# EAGLE schematic Arduino (EAGLE 6.6.0)
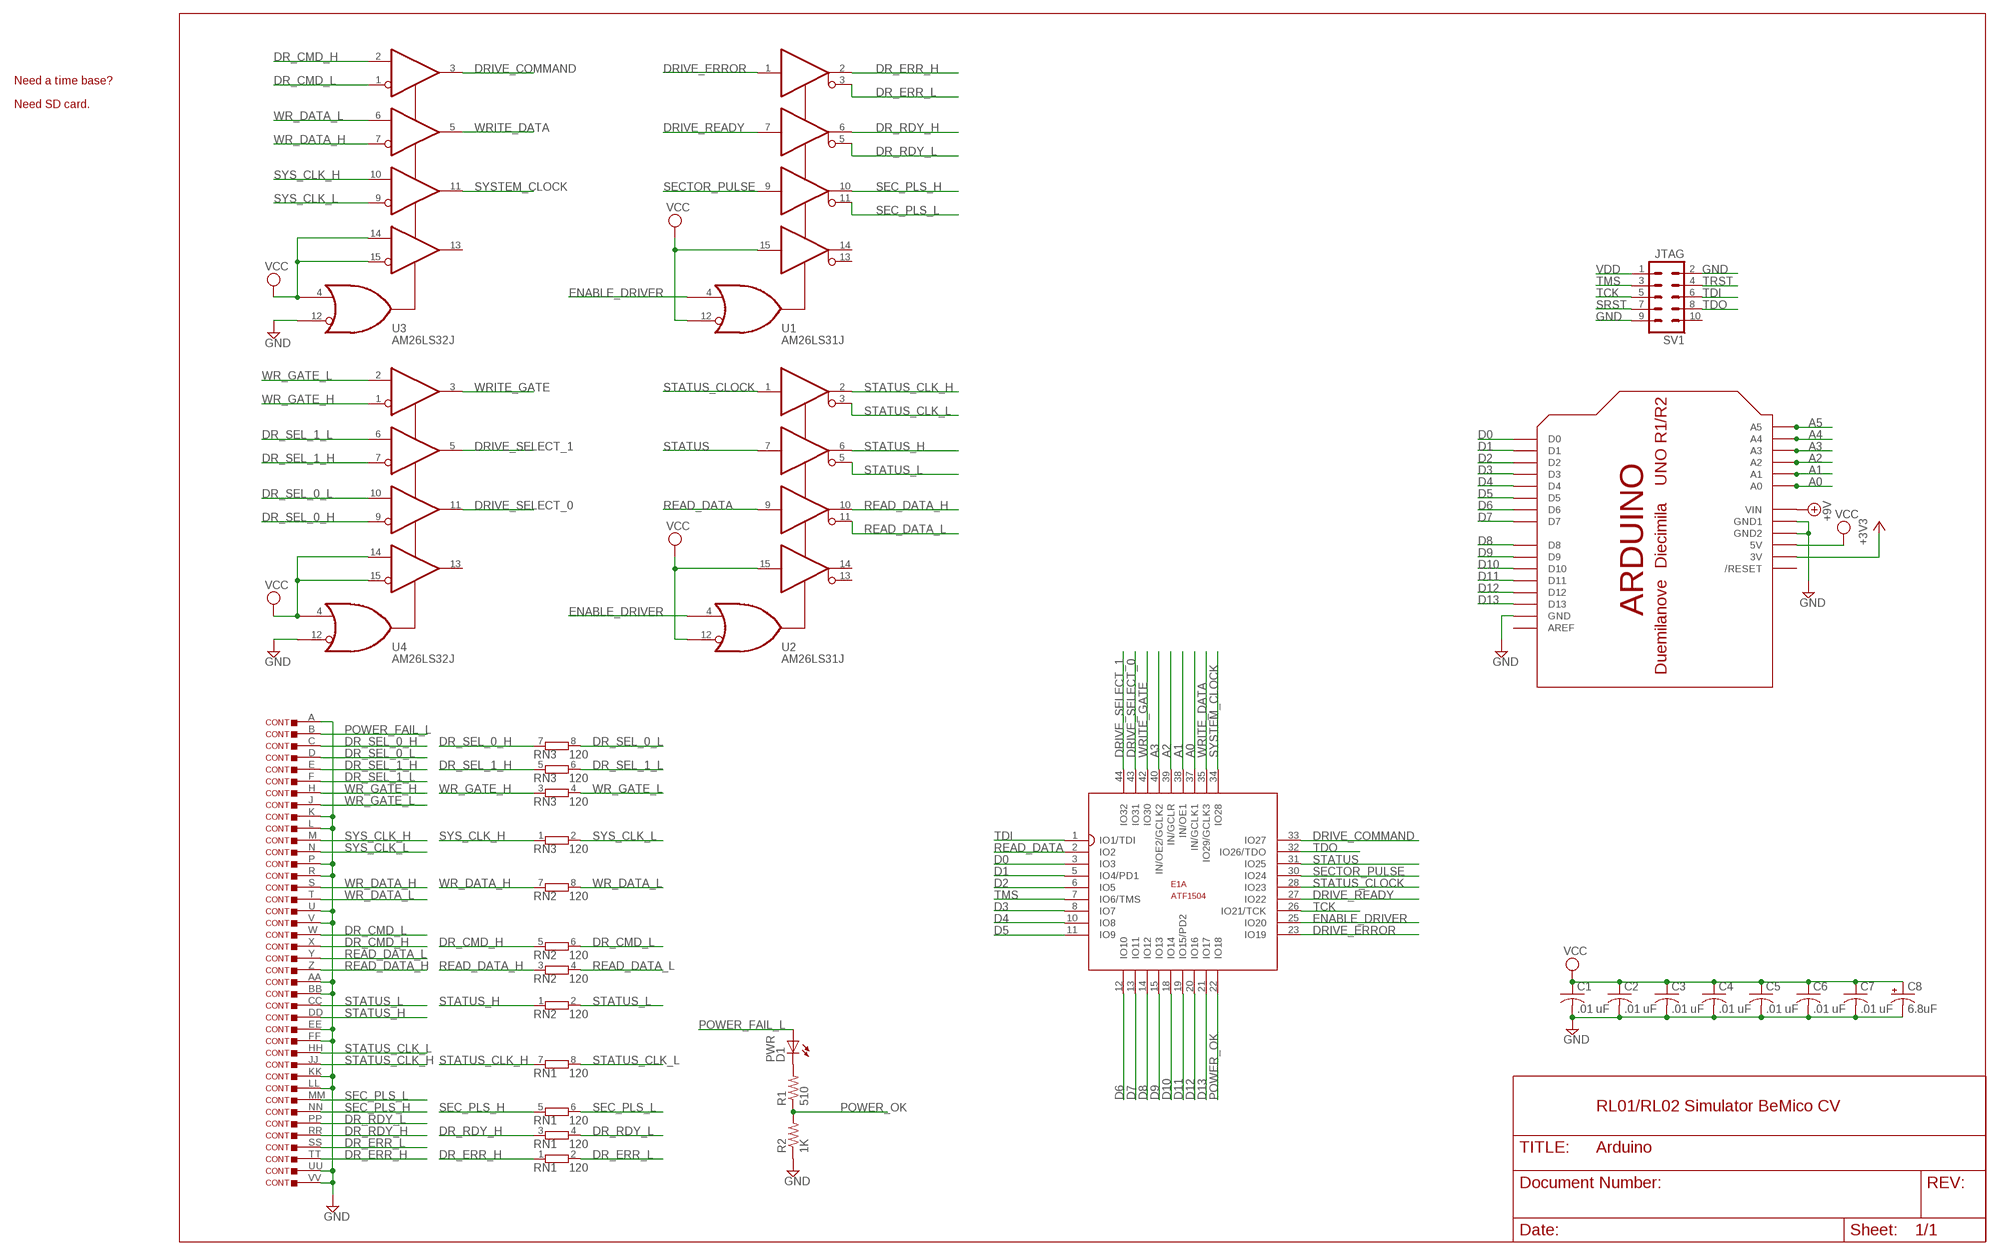
[diagram p0: schematic, sheet 1]

## Parts
C1  .01 uF  C-US050-025X075  [C050-025X075]
C2  .01 uF  C-US050-025X075  [C050-025X075]
C3  .01 uF  C-US050-025X075  [C050-025X075]
C4  .01 uF  C-US050-025X075  [C050-025X075]
C5  .01 uF  C-US050-025X075  [C050-025X075]
C6  .01 uF  C-US050-025X075  [C050-025X075]
C7  .01 uF  C-US050-025X075  [C050-025X075]
C8  6.8uF  CPOL-USE5-5  [E5-5]
CONT  DEC40PINSV  [DEC40PINV]
D1  PWR  LED5MM  [LED5MM]
E1  ATF1504  ATF150X44TQFP  [TQFP44]
R1  510  R-US_0207/10  [0207/10]
R2  1K  R-US_0207/10  [0207/10]
RN1  120  E4RP  [SIL8]
RN2  120  E4RP  [SIL8]
RN3  120  E4RP  [SIL8]
SV1  JTAG  ML10  [ML10]
U1  AM26LS31J  [SO16]
U2  AM26LS31J  [SO16]
U3  AM26LS32J  [SO16]
U4  AM26LS32J  [SO16]
U$3  ARDUINOUNO  [ARDUINO]

## Nets
+3V3: U$3.3V
+9V: U$3.VIN
A0: E1.37(A:IN/GCLK1) U$3.A0
A1: E1.38(A:IN/OE1) U$3.A1
A2: E1.39(A:IN/GCLR) U$3.A2
A3: E1.40(A:IN/OE2/GCLK2) U$3.A3
A4: U$3.A4
A5: U$3.A5
D0: E1.3(A:IO3) U$3.D0
D1: E1.5(A:IO4/PD1) U$3.D1
D2: E1.6(A:IO5) U$3.D2
D3: E1.8(A:IO7) U$3.D3
D4: E1.10(A:IO8) U$3.D4
D5: E1.11(A:IO9) U$3.D5
D6: E1.12(A:IO10) U$3.D6
D7: E1.13(A:IO11) U$3.D7
D8: E1.14(A:IO12) U$3.D8
D9: E1.15(A:IO13) U$3.D9
D10: E1.18(A:IO14) U$3.D10
D11: E1.19(A:IO15/PD2) U$3.D11
D12: E1.20(A:IO16) U$3.D12
D13: E1.21(A:IO17) U$3.D13
DR_CMD_H: CONT.X RN2.5 U3.2(P1)
DR_CMD_L: CONT.W RN2.6 U3.1(N1)
DR_ERR_H: CONT.TT RN1.1 U1.2(Y1)
DR_ERR_L: CONT.SS RN1.2 U1.3(Z1)
DR_RDY_H: CONT.RR RN1.3 U1.6(Y2)
DR_RDY_L: CONT.PP RN1.4 U1.5(Z2)
DR_SEL_0_H: CONT.C RN3.7 U4.9(N3)
DR_SEL_0_L: CONT.D RN3.8 U4.10(P3)
DR_SEL_1_H: CONT.E RN3.5 U4.7(N2)
DR_SEL_1_L: CONT.F RN3.6 U4.6(P2)
DRIVE_COMMAND: E1.33(A:IO27) U3.3(Y1)
DRIVE_ERROR: E1.23(A:IO19) U1.1(A1)
DRIVE_READY: E1.27(A:IO22) U1.7(A2)
DRIVE_SELECT_0: E1.43(A:IO31) U4.11(Y3)
DRIVE_SELECT_1: E1.44(A:IO32) U4.5(Y2)
ENABLE_DRIVER: E1.25(A:IO20) U1.4(G) U2.4(G)
GND [supply]: C1.2 C2.2 C3.2 C4.2 C5.2 C6.2 C7.2 C8.- CONT.A CONT.AA CONT.BB CONT.EE CONT.FF CONT.K CONT.KK CONT.L CONT.LL CONT.P CONT.R CONT.U CONT.UU CONT.V CONT.VV R2.1 SV1.2 SV1.9 U3.12(!G) U4.12(!G) U$3.GND U$3.GND1 U$3.GND2
N$1: D1.K(C) R1.2
N$2: U$3.AREF
N$9: U$3.RESET(/RESET)
POWER_FAIL_L: CONT.B D1.A
POWER_OK: E1.22(A:IO18) R1.1 R2.2
READ_DATA: E1.2(A:IO2) U2.9(A3)
READ_DATA_H: CONT.Z RN2.3 U2.10(Y3)
READ_DATA_L: CONT.Y RN2.4 U2.11(Z3)
SEC_PLS_H: CONT.NN RN1.5 U1.10(Y3)
SEC_PLS_L: CONT.MM RN1.6 U1.11(Z3)
SECTOR_PULSE: E1.30(A:IO24) U1.9(A3)
SRST: SV1.7
STATUS: E1.31(A:IO25) U2.7(A2)
STATUS_CLK_H: CONT.JJ RN1.7 U2.2(Y1)
STATUS_CLK_L: CONT.HH RN1.8 U2.3(Z1)
STATUS_CLOCK: E1.28(A:IO23) U2.1(A1)
STATUS_H: CONT.DD RN2.1 U2.6(Y2)
STATUS_L: CONT.CC RN2.2 U2.5(Z2)
SYS_CLK_H: CONT.M RN3.1 U3.10(P3)
SYS_CLK_L: CONT.N RN3.2 U3.9(N3)
SYSTEM_CLOCK: E1.34(A:IO28) U3.11(Y3)
TCK: E1.26(A:IO21/TCK) SV1.5
TDI: E1.1(A:IO1/TDI) SV1.6
TDO: E1.32(A:IO26/TDO) SV1.8
TMS: E1.7(A:IO6/TMS) SV1.3
TRST: SV1.4
VCC [supply]: C1.1 C2.1 C3.1 C4.1 C5.1 C6.1 C7.1 C8.+ U1.12(!G) U1.15(A4) U2.12(!G) U2.15(A4) U3.4(G) U3.14(P4) U3.15(N4) U4.4(G) U4.14(P4) U4.15(N4) U$3.5V
VDD: SV1.1
WR_DATA_H: CONT.S RN2.7 U3.7(N2)
WR_DATA_L: CONT.T RN2.8 U3.6(P2)
WR_GATE_H: CONT.H RN3.3 U4.1(N1)
WR_GATE_L: CONT.J RN3.4 U4.2(P1)
WRITE_DATA: E1.35(A:IO29/GCLK3) U3.5(Y2)
WRITE_GATE: E1.42(A:IO30) U4.3(Y1)
Unconnected: SV1.10 U1.13(Z4) U1.14(Y4) U2.13(Z4) U2.14(Y4) U3.13(Y4) U4.13(Y4)

## Notes on the sheet
- Need a time base?
- Need SD card.
- RL01/RL02 Simulator BeMico CV

## Power pins joined to a net without a drawn wire
GND: E1.4(GND) E1.16(GND) E1.24(GND) E1.36(GND) U1.8(GND) U2.8(GND) U3.8(GND) U4.8(GND)
VCC: E1.9(VCC) E1.17(VCC) E1.29(VCC) E1.41(VCC) U1.16(VCC) U2.16(VCC) U3.16(VCC) U4.16(VCC)

## Library data of the parts
C1-C7 = rcl:C-US: CAPACITOR, American symbol
C8 = rcl:CPOL-US: POLARIZED CAPACITOR, American symbol
CONT = dec-con:DEC40PINS: 40 pin ribbon connector for BC08, BC11 cables.
D1 = led:LED: LED OSRAM: - CHIPLED LG R971, LG N971, LY N971, LG Q971, LY Q971, LO R971, LY R971 LH N974, LH R974 LS Q976, LO Q976, LY Q976 LO Q996 - Hyper CHIPLED LW Q18S LB Q993, LB Q99A, LB R99A - SideLED LS A670, LO A670, LY A670, LG A670, LP A670 LB A673, LV A673, LT A673, LW A673 LH A674 LY A675 LS A676, LA A676, LO A676, LY A676, LW A676 LS A679, LY A679, LG A679 - Hyper Micro SIDELED® LS Y876, LA Y876, LO Y876, LY Y876 LT Y87S - SmartLED LW L88C, LW L88S LB L89C, LB L89S, LG L890 LS L89K, LO L89K, LY L89K LS L896, LA L896, LO L896, LY L896 - TOPLED LS T670, LO T670, LY T670, LG T670, LP T670 LSG T670, LSP T670, LSY T670, LOP T670, LYG T670 LG T671, LOG T671, LSG T671 LB T673, LV T673, LT T673, LW T673 LH T674 LS T676, LA T676, LO T676, LY T676, LB T676, LH T676, LSB T676, LW T676 LB T67C, LV T67C, LT T67C, LS T67K, LO T67K, LY T67K, LW E67C LS E67B, LA E67B, LO E67B, LY E67B, LB E67C, LV E67C, LT E67C LW T67C LS T679, LY T679, LG T679 LS T770, LO T770, LY T770, LG T770, LP T770 LB T773, LV T773, LT T773, LW T773 LH T774 LS E675, LA E675, LY E675, LS T675 LS T776, LA T776, LO T776, LY T776, LB T776 LHGB T686 LT T68C, LB T68C - Hyper Mini TOPLED® LB M676 - Mini TOPLED Santana® LG M470 LS M47K, LO M47K, LY M47K Source: http://www.osram.convergy.de LUXEON: - LUMILED® LXK2-PW12-R00, LXK2-PW12-S00, LXK2-PW14-U00, LXK2-PW14-V00 LXK2-PM12-R00, LXK2-PM12-S00, LXK2-PM14-U00 LXK2-PE12-Q00, LXK2-PE12-R00, LXK2-PE12-S00, LXK2-PE14-T00, LXK2-PE14-U00 LXK2-PB12-K00, LXK2-PB12-L00, LXK2-PB12-M00, LXK2-PB14-N00, LXK2-PB14-P00, LXK2-PB14-Q00 LXK2-PR12-L00, LXK2-PR12-M00, LXK2-PR14-Q00, LXK2-PR14-R00 LXK2-PD12-Q00, LXK2-PD12-R00, LXK2-PD12-S00 LXK2-PH12-R00, LXK2-PH12-S00 LXK2-PL12-P00, LXK2-PL12-Q00, LXK2-PL12-R00 Source: www.luxeon.com KINGBRIGHT: KA-3528ASYC Source: www.kingbright.com
E1 = atmel-cpld:ATF150X44: ATF150x in 44 pin packages
R1 R2 = rcl:R-US_: RESISTOR, American symbol
RN1-RN3 = resistor-sil:E4RP: SIL RESISTOR; OC_FARNELL: unknown; OC_NEWARK: unknown
SV1 = con-ml:ML10: HARTING; OC_FARNELL: unknown; OC_NEWARK: unknown
U1 U2 = dec-con:AM26LS31: Quad RS-422 Driver
U3 U4 = dec-con:AM26LS32: Quad Differential Reciever
U$3 = arduino:ARDUINO: Arduino Diecimila/Duemilanove Make a shield with ease, this package has all the named pins as well as the two mounting drill holes and an outline of the USB and DC power connector. The outline is on the DIMENSION layer, so if your board house uses it they will cut the outline to match. http://www.ladyada.net/library/pcb/eaglelibrary.html

## Net classes
1 supply: width 0.508 mm